# EAGLE schematic usb_light (EAGLE 8.4.3)
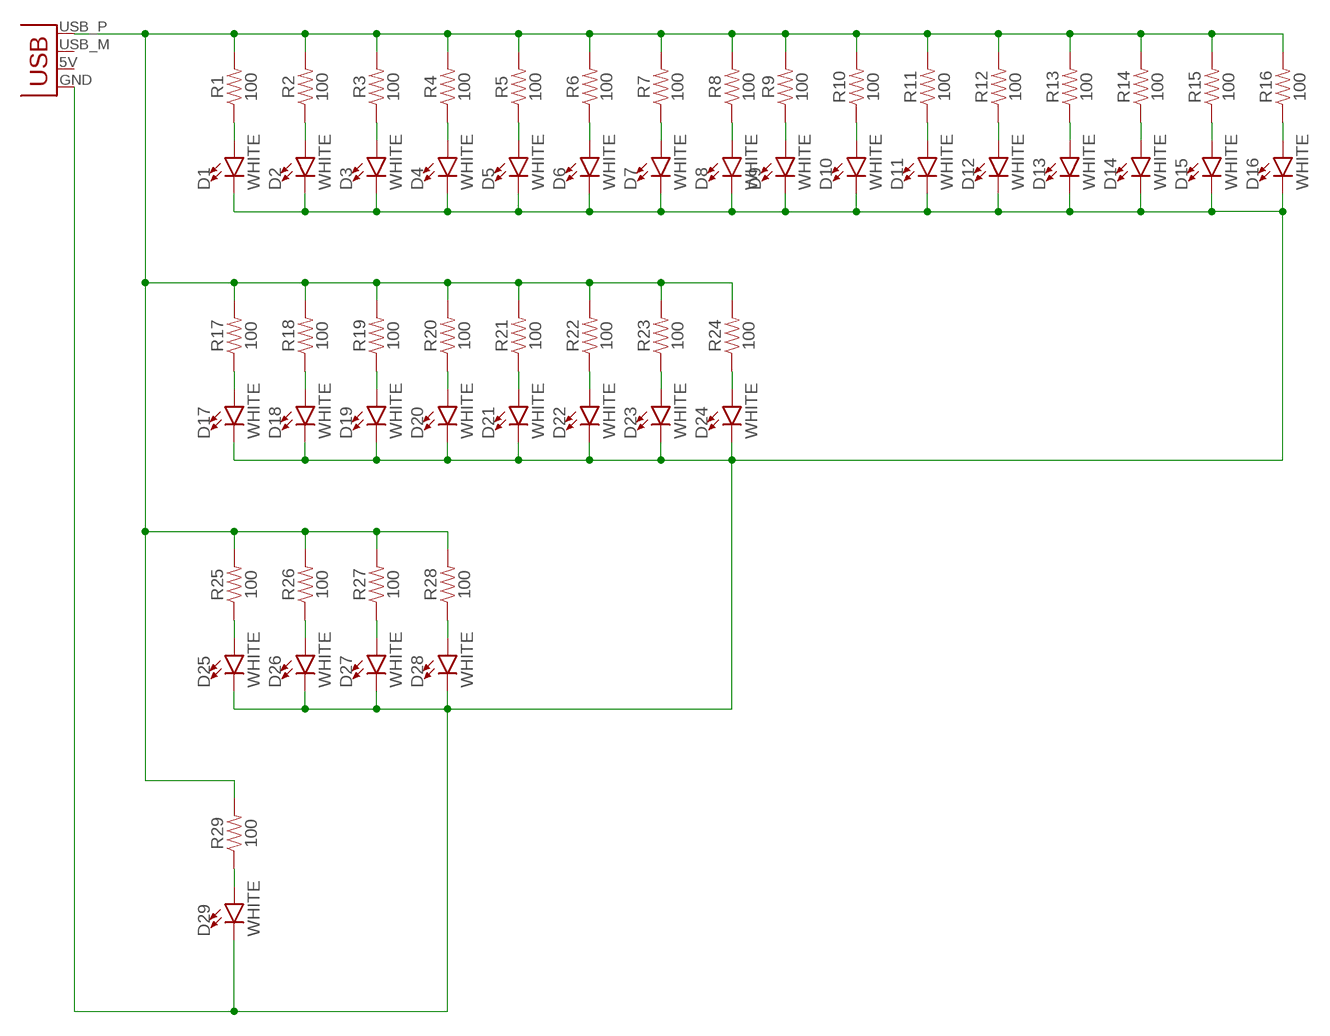
[diagram p0: schematic, sheet 1]

## Parts
D1  WHITE  LED-WHITE1206  [LED-1206]
D2  WHITE  LED-WHITE1206  [LED-1206]
D3  WHITE  LED-WHITE1206  [LED-1206]
D4  WHITE  LED-WHITE1206  [LED-1206]
D5  WHITE  LED-WHITE1206  [LED-1206]
D6  WHITE  LED-WHITE1206  [LED-1206]
D7  WHITE  LED-WHITE1206  [LED-1206]
D8  WHITE  LED-WHITE1206  [LED-1206]
D9  WHITE  LED-WHITE1206  [LED-1206]
D10  WHITE  LED-WHITE1206  [LED-1206]
D11  WHITE  LED-WHITE1206  [LED-1206]
D12  WHITE  LED-WHITE1206  [LED-1206]
D13  WHITE  LED-WHITE1206  [LED-1206]
D14  WHITE  LED-WHITE1206  [LED-1206]
D15  WHITE  LED-WHITE1206  [LED-1206]
D16  WHITE  LED-WHITE1206  [LED-1206]
D17  WHITE  LED-WHITE1206  [LED-1206]
D18  WHITE  LED-WHITE1206  [LED-1206]
D19  WHITE  LED-WHITE1206  [LED-1206]
D20  WHITE  LED-WHITE1206  [LED-1206]
D21  WHITE  LED-WHITE1206  [LED-1206]
D22  WHITE  LED-WHITE1206  [LED-1206]
D23  WHITE  LED-WHITE1206  [LED-1206]
D24  WHITE  LED-WHITE1206  [LED-1206]
D25  WHITE  LED-WHITE1206  [LED-1206]
D26  WHITE  LED-WHITE1206  [LED-1206]
D27  WHITE  LED-WHITE1206  [LED-1206]
D28  WHITE  LED-WHITE1206  [LED-1206]
D29  WHITE  LED-WHITE1206  [LED-1206]
R1  100  RESISTOR1206  [1206]
R2  100  RESISTOR1206  [1206]
R3  100  RESISTOR1206  [1206]
R4  100  RESISTOR1206  [1206]
R5  100  RESISTOR1206  [1206]
R6  100  RESISTOR1206  [1206]
R7  100  RESISTOR1206  [1206]
R8  100  RESISTOR1206  [1206]
R9  100  RESISTOR1206  [1206]
R10  100  RESISTOR1206  [1206]
R11  100  RESISTOR1206  [1206]
R12  100  RESISTOR1206  [1206]
R13  100  RESISTOR1206  [1206]
R14  100  RESISTOR1206  [1206]
R15  100  RESISTOR1206  [1206]
R16  100  RESISTOR1206  [1206]
R17  100  RESISTOR1206  [1206]
R18  100  RESISTOR1206  [1206]
R19  100  RESISTOR1206  [1206]
R20  100  RESISTOR1206  [1206]
R21  100  RESISTOR1206  [1206]
R22  100  RESISTOR1206  [1206]
R23  100  RESISTOR1206  [1206]
R24  100  RESISTOR1206  [1206]
R25  100  RESISTOR1206  [1206]
R26  100  RESISTOR1206  [1206]
R27  100  RESISTOR1206  [1206]
R28  100  RESISTOR1206  [1206]
R29  100  RESISTOR1206  [1206]
USB  USBPCB  [USB-A-PCB]

## Nets
N$1: D1.A R1.1
N$2: D1.C D2.C D3.C D4.C D5.C D6.C D7.C D8.C D9.C D10.C D11.C D12.C D13.C D14.C D15.C D16.C D17.C D18.C D19.C D20.C D21.C D22.C D23.C D24.C D25.C D26.C D27.C D28.C D29.C USB.GND
N$3: R1.2 R2.2 R3.2 R4.2 R5.2 R6.2 R7.2 R8.2 R9.2 R10.2 R11.2 R12.2 R13.2 R14.2 R15.2 R16.2 R17.2 R18.2 R19.2 R20.2 R21.2 R22.2 R23.2 R24.2 R25.2 R26.2 R27.2 R28.2 R29.2 USB.USB_P(D+)
N$4: D2.A R2.1
N$5: D17.A R17.1
N$7: D3.A R3.1
N$9: D18.A R18.1
N$10: D4.A R4.1
N$11: D19.A R19.1
N$12: D20.A R20.1
N$13: D5.A R5.1
N$14: D21.A R21.1
N$15: D22.A R22.1
N$16: D6.A R6.1
N$17: D23.A R23.1
N$18: D24.A R24.1
N$19: D7.A R7.1
N$20: D25.A R25.1
N$22: D8.A R8.1
N$24: D26.A R26.1
N$25: D9.A R9.1
N$26: D27.A R27.1
N$27: D28.A R28.1
N$28: D10.A R10.1
N$29: D29.A R29.1
N$31: D11.A R11.1
N$34: D12.A R12.1
N$37: D13.A R13.1
N$40: D14.A R14.1
N$43: D15.A R15.1
N$46: D16.A R16.1
Unconnected: USB.5V(VBUS) USB.USB_M(D-)

## Library data of the parts
D1-D29 = SparkFun-LED:LED-WHITE: White SMD LED Used in manufacturing several products at SparkFun. Packages: 0603 - Bright White SMD 0603 package[Product Link] <http://www.kingbrightusa.com/product.asp?catalog_name=LED&product_id=APT1608QWF/D> 1206 - Bright White SMD1206 package [Product Link] <http://www.kingbrightusa.com/product.asp?catalog_name=LED&product_id=APT3216QWF/D> 3014 - Super Bright SMD 3014 package [Datasheet] <http://www.lumileds.com/uploads/459/DS208-pdf> SparkFun Products: Blackberry Trackballer Breakout <https://www.sparkfun.com/products/13169> Digital SandBox <https://www.sparkfun.com/products/12651>; PROD_ID: DIO-09955
R1-R29 = SparkFun-Resistors:RESISTOR: Generic Resistor Package
USB = SparkFun:USB: USB Connectors USB-B-PTH is fully proven SKU : PRT-00139 USB-miniB is fully proven SKU : PRT-00587 USB-A-PCB is untested. USB-A-H is throughly reviewed, but untested. Spark Fun Electronics SKU : PRT-00437 USB-B-SMT is throughly reviewed, but untested. Needs silkscreen touching up. USB-A-S has not been used/tested USB-MB-H has not been used/tested

## Net classes
0 default: clearance 0.205 mm